# EasyEDA Pro project ProPrj_RP2040 SERVO BOARD_2026-06-01.epro

# Schematic Schematic1
Board Name: Board1; Create Date: 2026-05-31; Page Name: P1; Project Name: RP2040 SERVO BOARD; Schematic Name: Schematic1; Update Date: 2026-05-31; Company: EasyEDA.com; Page Size: A4; Version: V1.0
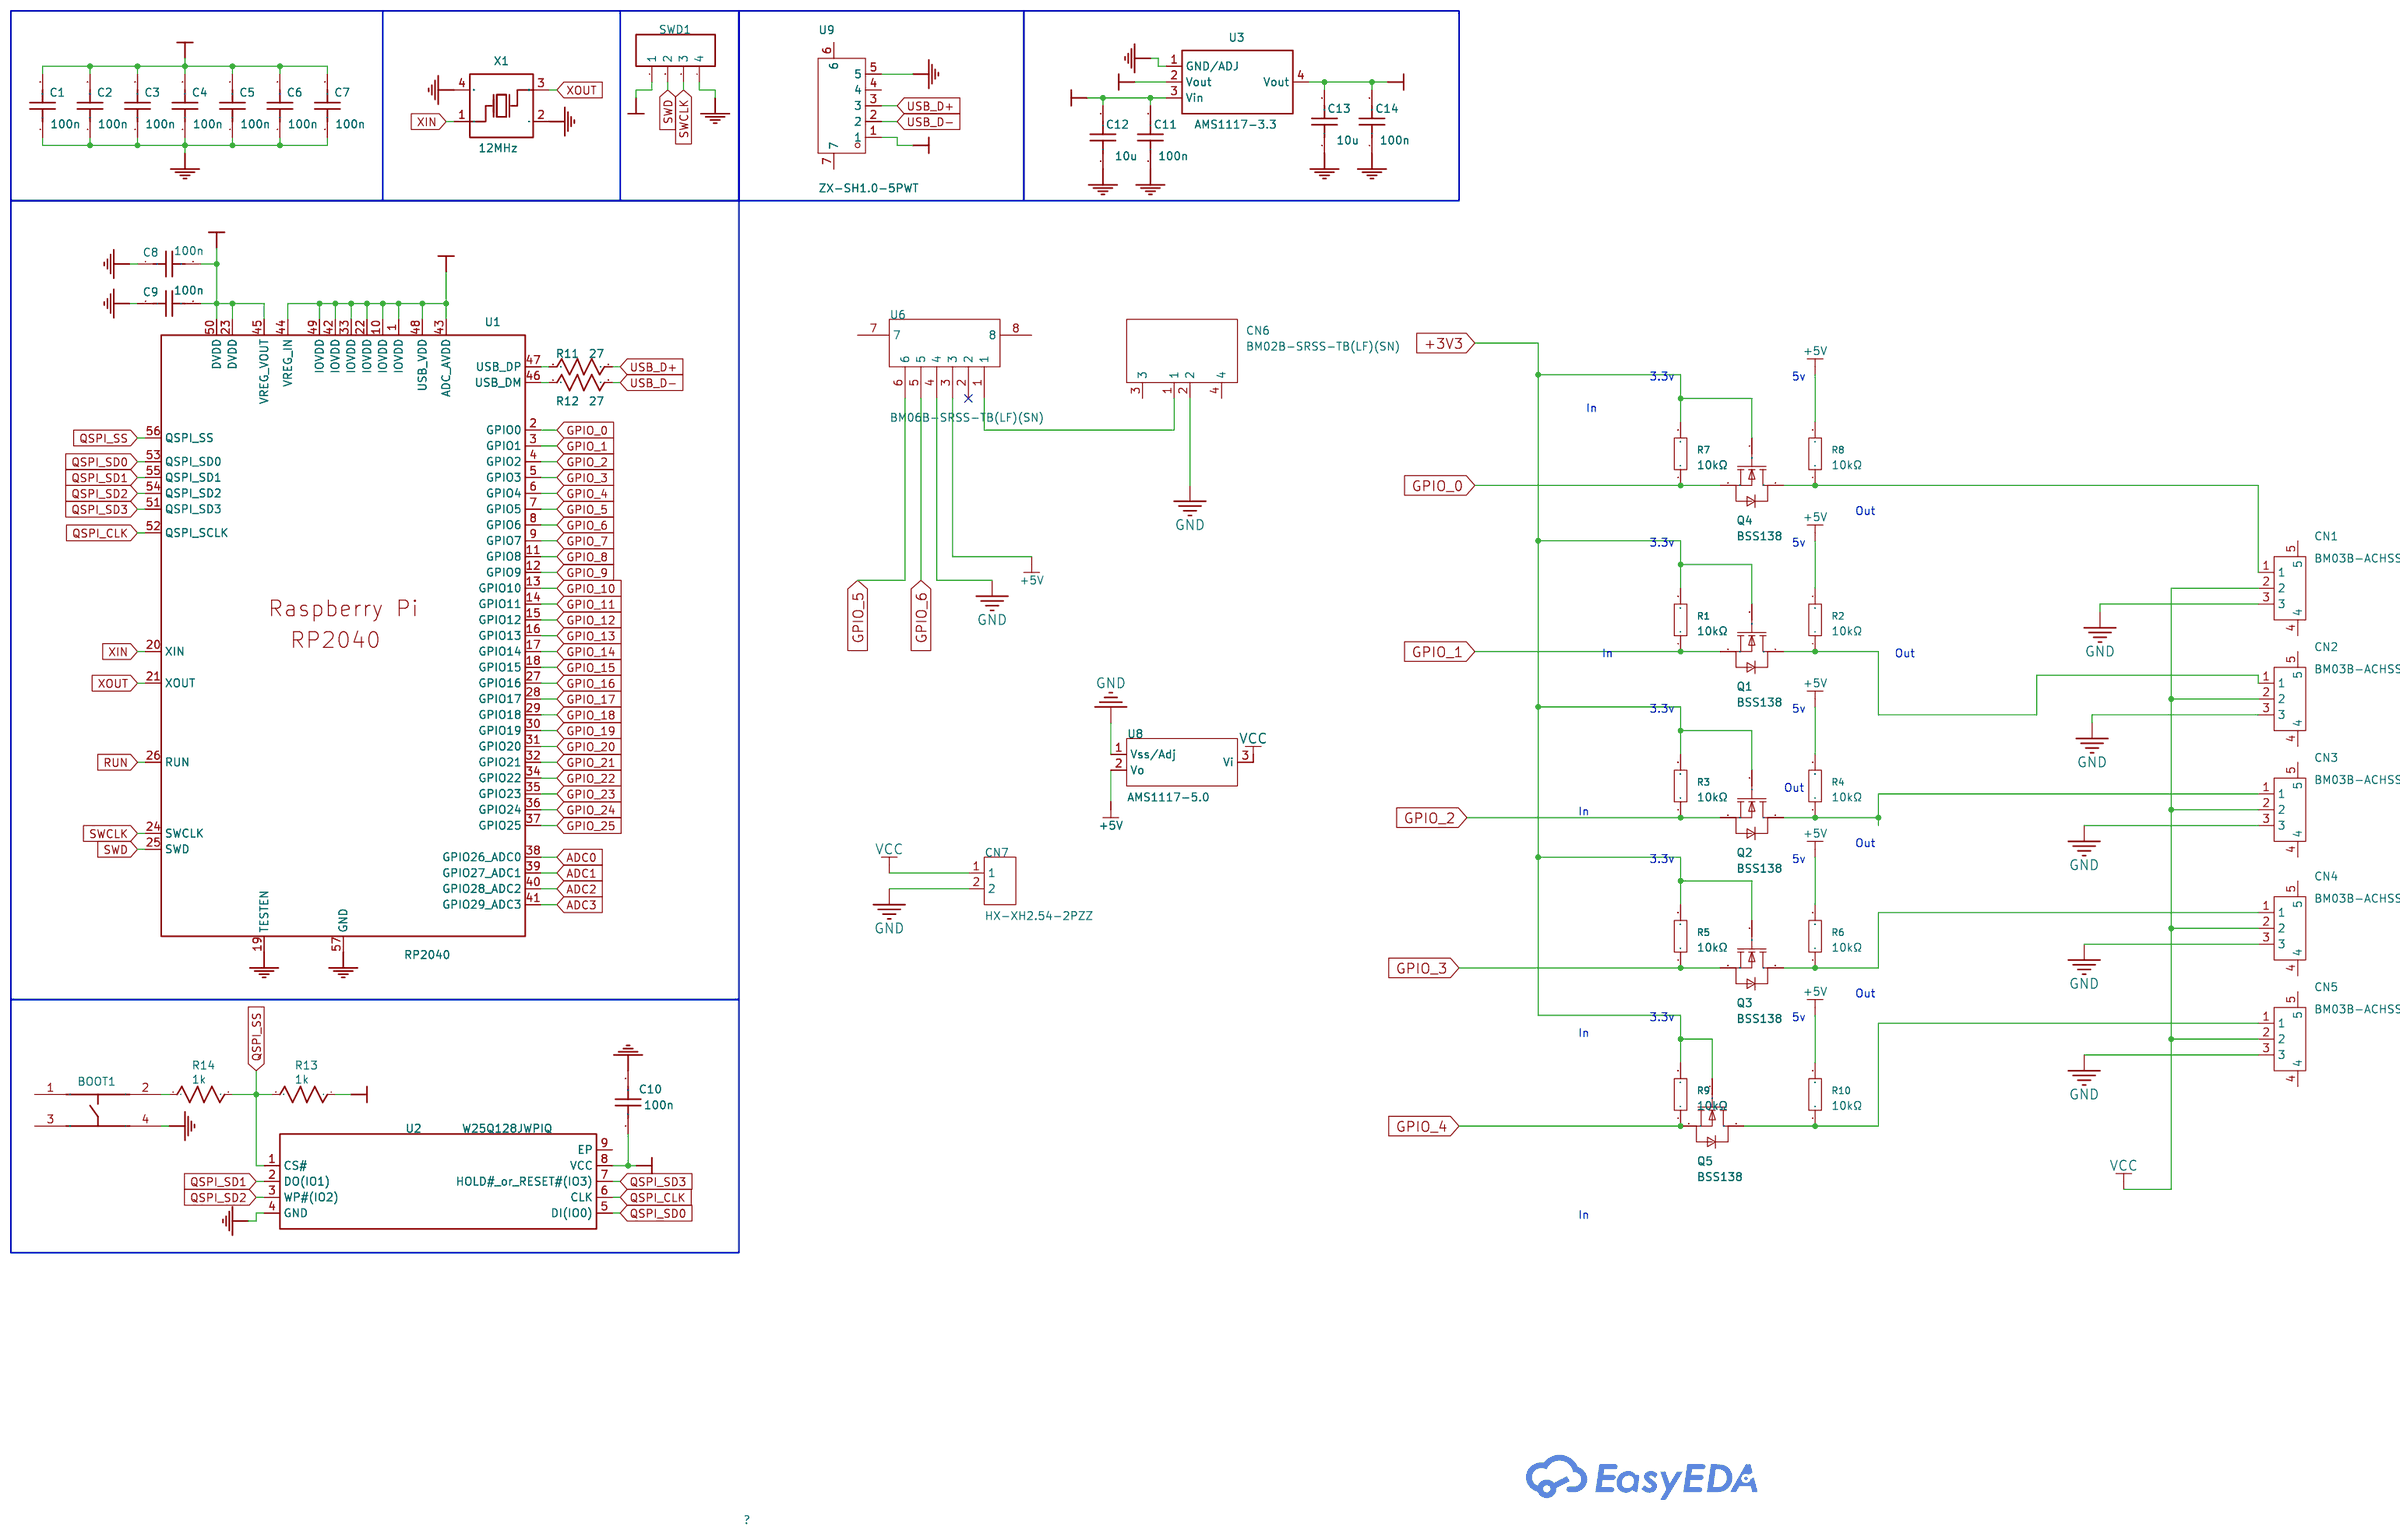
[diagram p0: schematic sheet]

## Parts
BOOT1  PTS810SJM250SMTRLFS  [KEY-SMD_4P-L4.2-W3.2-P2.20-LS4.6]
C1  100n  [C0603]
C2  100n  [C0603]
C3  100n  [C0603]
C4  100n  [C0603]
C5  100n  [C0603]
C6  100n  [C0603]
C7  100n  [C0603]
C8  100n  [C0603]
C9  100n  [C0603]
C10  100n  [C0603]
C11  100n  [C0603]
C12  10u  [C0603]
C13  10u  [C0603]
C14  100n  [C0603]
CN1  BM03B-ACHSS-GAN-TF(LF)(SN)  [CONN-SMD_3P-P1.20_BM03B-ACHSS-GAN-TF]
CN2  BM03B-ACHSS-GAN-TF(LF)(SN)  [CONN-SMD_3P-P1.20_BM03B-ACHSS-GAN-TF]
CN3  BM03B-ACHSS-GAN-TF(LF)(SN)  [CONN-SMD_3P-P1.20_BM03B-ACHSS-GAN-TF]
CN4  BM03B-ACHSS-GAN-TF(LF)(SN)  [CONN-SMD_3P-P1.20_BM03B-ACHSS-GAN-TF]
CN5  BM03B-ACHSS-GAN-TF(LF)(SN)  [CONN-SMD_3P-P1.20_BM03B-ACHSS-GAN-TF]
CN6  BM02B-SRSS-TB(LF)(SN)  [CONN-TH_BM02B-SRSS-TB-LF-SN]
CN7  HX-XH2.54-2PZZ  [CONN-TH_2P-P2.50_HX-2.54MM-2P-ZZ-MS]
Q1  BSS138  [SOT-23-3_L3.0-W1.7-P0.95-LS2.9-BR]
Q2  BSS138  [SOT-23-3_L3.0-W1.7-P0.95-LS2.9-BR]
Q3  BSS138  [SOT-23-3_L3.0-W1.7-P0.95-LS2.9-BR]
Q4  BSS138  [SOT-23-3_L3.0-W1.7-P0.95-LS2.9-BR]
Q5  BSS138  [SOT-23-3_L3.0-W1.7-P0.95-LS2.9-BR]
R1  10kΩ  [R0402]
R2  10kΩ  [R0402]
R3  10kΩ  [R0402]
R4  10kΩ  [R0402]
R5  10kΩ  [R0402]
R6  10kΩ  [R0402]
R7  10kΩ  [R0402]
R8  10kΩ  [R0402]
R9  10kΩ  [R0402]
R10  10kΩ  [R0402]
R11  27  [R0603]
R12  27  [R0603]
R13  1k  [R0603]
R14  1k  [R0603]
SWD1  HDR-M-2.54_1x4  [HDR-M-2.54_1X4]
U1  RP2040  [LQFN-56_L7.0-W7.0-P0.4-EP]
U2  W25Q128JWPIQ  [WSON-8_L6.0-W5.0-P1.27-BL-EP]
U3  AMS1117-3.3  [SOT-223-3_L6.5-W3.4-P2.30-LS7.0-BR]
U6  BM06B-SRSS-TB(LF)(SN)  [CONN-SMD-6P-P1.00_BM06B-SRSS-TB-LF-SN]
U8  AMS1117-5.0  [SOT-89-3_L4.5-W2.5-P1.50-LS4.0-BR-1]
U9  ZX-SH1.0-5PWT  [CONN-SMD_5P-P1.00_MEGASTAR_ZX-SH1.0-5PWT]
X1  12MHz  [CRYSTAL-SMD_4P-L3.2-W2.5-BL]

## Library data of the parts
BOOT1 = PTS810SJM250SMTRLFS: Supplier: LCSC; Supplier Part: C116501; Manufacturer: C&K; JLCPCB Part Class: Extended Part; Contributor: LCSC; spicePre: S
C1-C11 C14 = 100n: nameAlias: Value(F); Contributor: LCEDA_Lib; spicePre: C; spiceSymbolName: C_0603_US
C12 C13 = 10u: nameAlias: Value(F); Contributor: LCEDA_Lib; spicePre: C; spiceSymbolName: C_0603_US
CN1-CN5 = BM03B-ACHSS-GAN-TF(LF)(SN): LCSC Part Name: 可断开压接式连接器，1.2mm间距; Supplier Part: C4353737; Manufacturer: JST; Supplier Footprint: SMD-3P; JLCPCB Part Class: Extended Part; Datasheet: https://item.szlcsc.com/datasheet/BM03B-ACHSS-GAN-TF(LF)(SN)/4924319.html; Supplier: LCSC
CN6 = BM02B-SRSS-TB(LF)(SN): Pins Structure:1x2P Pitch:1mm Mounting Type:Surface Mount,Vertical Reference Series:SH Number of Pins:2P Number of Rows:1 Number of PINs Per Row:2 Row Spacing:- Current Rating:1A Contact Material:Copper Alloy Contact Plating:Tin Operating Temperature:-25℃; LCSC Part Name: 1x2P 间距:1mm 立贴 系列:SH; Supplier Part: C160388; Manufacturer: JST; Supplier Footprint: SMD,P=1mm; JLCPCB Part Class: Extended Part; Datasheet: https://item.szlcsc.com/datasheet/BM02B-SRSS-TB(LF)(SN)/171768.html; Supplier: LCSC; Pins Structure: 1x2P; Pitch: 1mm; Mounting Type: Surface Mount,Vertical; Reference Series: SH; Number of Pins: 2P; Number of Rows: 1; Number of PINs Per Row: 2; Current Rating: 1A; Contact Material: Copper Alloy; Contact Plating: Tin; Operating Temperature: -25℃~+85℃; Voltage Rating: 50V; Plastic Material: PA; Flame Retardant Rating: UL94V-0; Supplementary Features: Auxiliary Solder Pin; Color: White; Z-Height of the Board: 4.25mm; X-Length of Bottom Edge on Board (Spacing Line): 4mm; Y-Width of Bottom Edge on Board: 3.6mm
CN7 = HX-XH2.54-2PZZ: Pins Structure:1x2P Pitch:2.54mm Mounting Type:Straight Reference Series:XH Number of Pins:2P Number of Rows:1 Number of PINs Per Row:2 Row Spacing:- Current Rating:3A Contact Material:Brass Contact Plating:Tin Operating Temperature:-25℃~+85℃ Operating Te; LCSC Part Name: 1x2P 间距:2.5mm 直插 系列:XH; Supplier Part: C42391660; Manufacturer: hanxia(韩下); Supplier Footprint: 插件,P=2.5mm; JLCPCB Part Class: Extended Part; Datasheet: https://item.szlcsc.com/datasheet/HX-XH2.54-2PZZ/44326932.html; Supplier: LCSC; Pins Structure: 1x2P; Pitch: 2.54mm; Mounting Type: Straight; Reference Series: XH; Number of Pins: 2P; Number of Rows: 1; Number of PINs Per Row: 2; Current Rating: 3A; Contact Material: Brass; Contact Plating: Tin; Operating Temperature: -25℃~+85℃; Voltage Rating: 250V; Plastic Material: PA66; Flame Retardant Rating: UL94V-0; Color: White
Q1-Q5 = BSS138_C53058666: Number:1 N-channel Drain to Source Voltage:50V Current - Continuous Drain(Id):- RDS(on):3.5Ω@10V Pd - Power Dissipation:350mW Gate Threshold Voltage (Vgs(th)):1.5V Gate Charge(Qg):- Input Capacitance(Ciss):27pF Reverse Transfer Capacitance (Crss@Vds):6pF; Supplier Part: C53058666; Manufacturer: luJing(鲁晶); Supplier Footprint: SOT-23; JLCPCB Part Class: Extended Part; Datasheet: https://item.szlcsc.com/datasheet/BSS138/56008455.html; Supplier: LCSC; Number: 1 N-channel; Drain to Source Voltage: 50V; RDS(on): 3.5Ω@10V; Pd - Power Dissipation: 350mW; Gate Threshold Voltage (Vgs(th)): 1.5V; Input Capacitance(Ciss): 27pF; Reverse Transfer Capacitance (Crss@Vds): 6pF; Operating Temperature: -55℃~+150℃; Type: N-Channel; Output Capacitance(Coss): 13pF; Vgs: ±20V
R1-R10 = TR0402D10K0Q1025Z: Type:Thin Film Resistor Resistance: Tolerance:±0.5% Tolerance:±0.5% Power(Watts): Overload Voltage (Max): Temperature Coefficient:±25ppm/℃ Temperature Coefficient:±25ppm/℃ Operating Temperature Range:-55℃~+155℃ Operating Temperature Range:-55℃~+155℃; LCSC Part Name: 薄膜电阻 10kΩ ±0.5% 63mW; Supplier Part: C149898; Manufacturer: EVER OHMS(天二科技); Supplier Footprint: 0402; JLCPCB Part Class: Extended Part; Datasheet: https://atta.szlcsc.com/upload/public/pdf/source/20190527/C149900_32B1354086E9F6A772108AB7B2B7A514.pdf; Supplier: LCSC; Type: Thin Film Resistor; Tolerance: ±0.5%; Temperature Coefficient: ±25ppm/℃; Operating Temperature Range: -55℃~+155℃
R11 R12 = 27: nameAlias: Value(Ω); Contributor: LCEDA_Lib; spicePre: R; spiceSymbolName: R_0603_US
R13 R14 = 1k: nameAlias: Value(Ω); Contributor: LCEDA_Lib; spicePre: R; spiceSymbolName: R_0603_US
SWD1 = HDR-M-2.54_1x4: Supplier Part: C124378; Supplier: LCSC; Contributor: LCEDA_Lib; spicePre: J
U1 = RP2040: Supplier: LCSC; Supplier Part: C2040; Manufacturer: Raspberry Pi(树莓派); JLCPCB Part Class: Extended Part; Contributor: LCSC; spicePre: U
U2 = W25Q128JWPIQ: Supplier: LCSC; Supplier Part: C2689660; Manufacturer: WINBOND(华邦); JLCPCB Part Class: Extended Part; Contributor: LCSC; spicePre: U
U3 = AMS1117-3.3: Supplier: LCSC; Manufacturer: AMS; Supplier Part: C6186; JLCPCB Part Class: Basic Part; sourceId: dwIGgezVh; timeStamp: 1476261164; spicePre: U
U6 = BM06B-SRSS-TB(LF)(SN): Pins Structure:1x6P Pitch:1mm Mounting Type:Surface Mount,Vertical Reference Series:SH Number of Pins:6P Number of Rows:1 Number of PINs Per Row:6 Row Spacing:- Current Rating:1A Contact Material:Copper Alloy Contact Plating:Tin Operating Temperature:-25℃; LCSC Part Name: 1x6P 间距:1mm 立贴 系列:SH; Supplier Part: C160392; Manufacturer: JST; Supplier Footprint: SMD,P=1mm; JLCPCB Part Class: Extended Part; Datasheet: https://item.szlcsc.com/datasheet/BM06B-SRSS-TB(LF)(SN)/171772.html; Supplier: LCSC; Pins Structure: 1x6P; Pitch: 1mm; Mounting Type: Surface Mount,Vertical; Reference Series: SH; Number of Pins: 6P; Number of Rows: 1; Number of PINs Per Row: 6; Current Rating: 1A; Contact Material: Copper Alloy; Contact Plating: Tin; Operating Temperature: -25℃~+85℃; Voltage Rating: 50V; Plastic Material: PA; Flame Retardant Rating: UL94V-0; Supplementary Features: Auxiliary Solder Pin; Color: White; Z-Height of the Board: 4.25mm; X-Length of Bottom Edge on Board (Spacing Line): 8mm; Y-Width of Bottom Edge on Board: 3.6mm
U8 = AMS1117-5.0_C42410722: Output Type:Fixed Voltage - Supply:15V Output Voltage:5V Output Voltage:5V Output Current:1A Power Supply Rejection Ratio (PSRR):- Voltage Dropout:1.1V@(1A) standby current:2mA Noise:0.003%Vout Features:Over Current Protection；Short Circuit Protection；The; LCSC Part Name: 5V 1A 15V; Supplier Part: C42410722; Manufacturer: FOSAN(富捷/富信); Supplier Footprint: SOT-89-3L; JLCPCB Part Class: Extended Part; Datasheet: https://item.szlcsc.com/datasheet/AMS1117-5.0/44388993.html; Supplier: LCSC; Output Type: Fixed; Voltage - Supply: 15V; Output Voltage: 5V; Output Current: 1A; Voltage Dropout: 1.1V@(1A); standby current: 2mA; Noise: 0.003%Vout; Features: Over Current Protection；Short Circuit Protection；Thermal Shutdown; Operating Temperature: -40℃~+125℃; Output Configuration: Positive; Number of Outputs: 1
U9 = ZX-SH1.0-5PWT: Pins Structure:1x5P Pitch:1mm Mounting Type:Surface Mount, Right Angle Reference Series:SH Number of Pins:5P Number of Rows:1 Number of PINs Per Row:5 Row Spacing:- Current Rating:1A Contact Material:Brass Contact Plating:Tin Operating Temperature:-40℃~+8; LCSC Part Name: 1x5P 间距:1mm 卧贴 系列:SH; Supplier Part: C7430447; Manufacturer: Megastar(兆星); Supplier Footprint: SMD,P=1mm,卧贴; JLCPCB Part Class: Extended Part; Datasheet: https://item.szlcsc.com/datasheet/ZX-SH1.0-5PWT/8430316.html; Supplier: LCSC; Pins Structure: 1x5P; Pitch: 1mm; Mounting Type: Surface Mount, Right Angle; Reference Series: SH; Number of Pins: 5P; Number of Rows: 1; Number of PINs Per Row: 5; Current Rating: 1A; Contact Material: Brass; Contact Plating: Tin; Operating Temperature: -40℃~+85℃; Voltage Rating: 50V; Plastic Material: LCP; Supplementary Features: Auxiliary Solder Pin; Color: Beige; Z-Height of the Board: 3.15mm; X-Length of Bottom Edge on Board (Spacing Line): 7.35mm; Y-Width of Bottom Edge on Board: 4.3mm
X1 = 12MHz: Supplier: LCSC; Manufacturer: TAE; Manufacturer Part: SMD-3225_4P12M12pf10ppm; Supplier Part: C133337; JLCPCB Part Class: Extended Part; nameAlias: Frequency; Contributor: LCSC; spicePre: X; spiceSymbolName: SMD-3225_4P12M12PF10PPM

## Nets
+1V1: C8.2 C9.2 U1.23(DVDD) U1.45(VREG_VOUT) U1.50(DVDD)
+3.3V: U1.1(IOVDD) U1.10(IOVDD) U1.22(IOVDD) U1.33(IOVDD) U1.42(IOVDD) U1.43(ADC_AVDD) U1.44(VREG_IN) U1.48(USB_VDD) U1.49(IOVDD)
+3V3: C1.2 C2.2 C3.2 C4.2 C5.2 C6.2 C7.2 C10.1 C13.2 C14.2 Q1.1(G) Q2.1(G) Q3.1(G) Q4.1(G) Q5.1(G) R1.2 R3.2 R5.2 R7.2 R9.2 R13.1 SWD1.1 U2.8(VCC) U3.2(Vout) U3.4(Vout)
+5V: C11.2 C12.2 R2.2 R4.2 R6.2 R8.2 R10.2 U3.3(Vin) U6.3 U8.2(Vo) U9.1
GND: BOOT1.4 C1.1 C2.1 C3.1 C4.1 C5.1 C6.1 C7.1 C8.1 C9.1 C10.2 C11.1 C12.1 C13.1 C14.1 CN1.3 CN2.3 CN3.3 CN4.3 CN5.3 CN6.2 CN7.2 SWD1.4 U1.19(TESTEN) U1.57(GND) U2.4(GND) U3.1(GND/ADJ) U6.4 U8.1(Vss/Adj) U9.5 X1.2(GND) X1.4(GND)
VCC: CN1.2 CN2.2 CN3.2 CN4.2 CN5.2 CN7.1 U8.3(Vi)
ADC0: U1.38(GPIO26_ADC0)
ADC1: U1.39(GPIO27_ADC1)
ADC2: U1.40(GPIO28_ADC2)
ADC3: U1.41(GPIO29_ADC3)
GPIO_0: Q4.2(S) R7.1 U1.2(GPIO0)
GPIO_1: Q1.2(S) R1.1 U1.3(GPIO1)
GPIO_2: Q2.2(S) R3.1 U1.4(GPIO2)
GPIO_3: Q3.2(S) R5.1 U1.5(GPIO3)
GPIO_4: Q5.2(S) R9.1 U1.6(GPIO4)
GPIO_5: U1.7(GPIO5) U6.6
GPIO_6: U1.8(GPIO6) U6.5
GPIO_7: U1.9(GPIO7)
GPIO_8: U1.11(GPIO8)
GPIO_9: U1.12(GPIO9)
GPIO_10: U1.13(GPIO10)
GPIO_11: U1.14(GPIO11)
GPIO_12: U1.15(GPIO12)
GPIO_13: U1.16(GPIO13)
GPIO_14: U1.17(GPIO14)
GPIO_15: U1.18(GPIO15)
GPIO_16: U1.27(GPIO16)
GPIO_17: U1.28(GPIO17)
GPIO_18: U1.29(GPIO18)
GPIO_19: U1.30(GPIO19)
GPIO_20: U1.31(GPIO20)
GPIO_21: U1.32(GPIO21)
GPIO_22: U1.34(GPIO22)
GPIO_23: U1.35(GPIO23)
GPIO_24: U1.36(GPIO24)
GPIO_25: U1.37(GPIO25)
QSPI_CLK: U1.52(QSPI_SCLK) U2.6(CLK)
QSPI_SD0: U1.53(QSPI_SD0) U2.5(DI(IO0))
QSPI_SD1: U1.55(QSPI_SD1) U2.2(DO(IO1))
QSPI_SD2: U1.54(QSPI_SD2) U2.3(WP#(IO2))
QSPI_SD3: U1.51(QSPI_SD3) U2.7(HOLD# or RESET#(IO3))
QSPI_SS: R13.2 R14.2 U1.56(QSPI_SS) U2.1(CS#)
RUN: U1.26(RUN)
SWCLK: SWD1.3 U1.24(SWCLK)
SWD: SWD1.2 U1.25(SWD)
USB_D+: R11.2 U9.3
USB_D-: R12.2 U9.2
XIN: U1.20(XIN) X1.1(OSC1)
XOUT: U1.21(XOUT) X1.3(OSC2)
$1N3777: CN6.1 U6.1
$1N4045: CN1.1 Q4.3(D) R8.1
$1N4059: CN2.1 Q1.3(D) R2.1
$1N4218: CN3.1 Q2.3(D) R4.1
$1N4230: CN4.1 Q3.3(D) R6.1
$1N6983: R12.1 U1.46(USB_DM)
$1N6984: R11.1 U1.47(USB_DP)
$1N7040: BOOT1.2 R14.1
$1N10693: CN5.1 Q5.3(D) R10.1

Not connected (* = marked no-connect by the designer): BOOT1 1 3; CN1 4 5; CN2 4 5; CN3 4 5; CN4 4 5; CN5 4 5; CN6 3 4; U2 9(EP); U6 2* 7 8; U9 4 6 7

## Notes on the sheet
- 3.3v
- 5v
- In
- Out
- 3.3v
- 5v
- In
- Out
- 3.3v
- 5v
- Out
- In
- Out
- 3.3v
- 5v
- Out
- 3.3v
- 5v
- In
- In

# Board PCB1
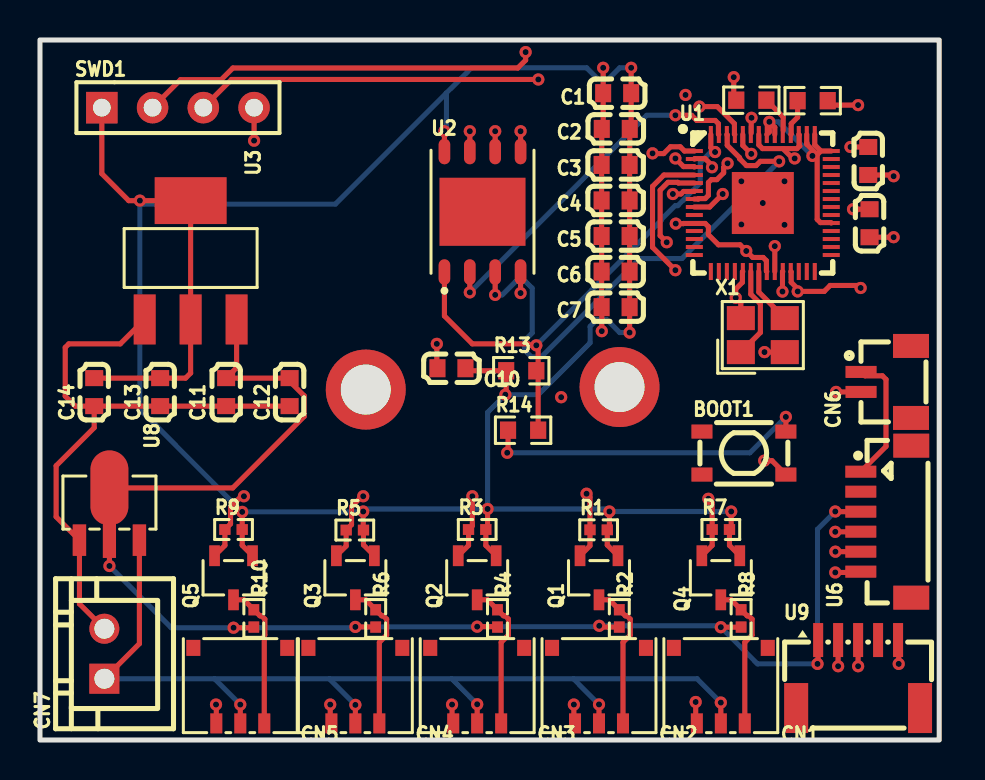
[diagram p1: board, top side]
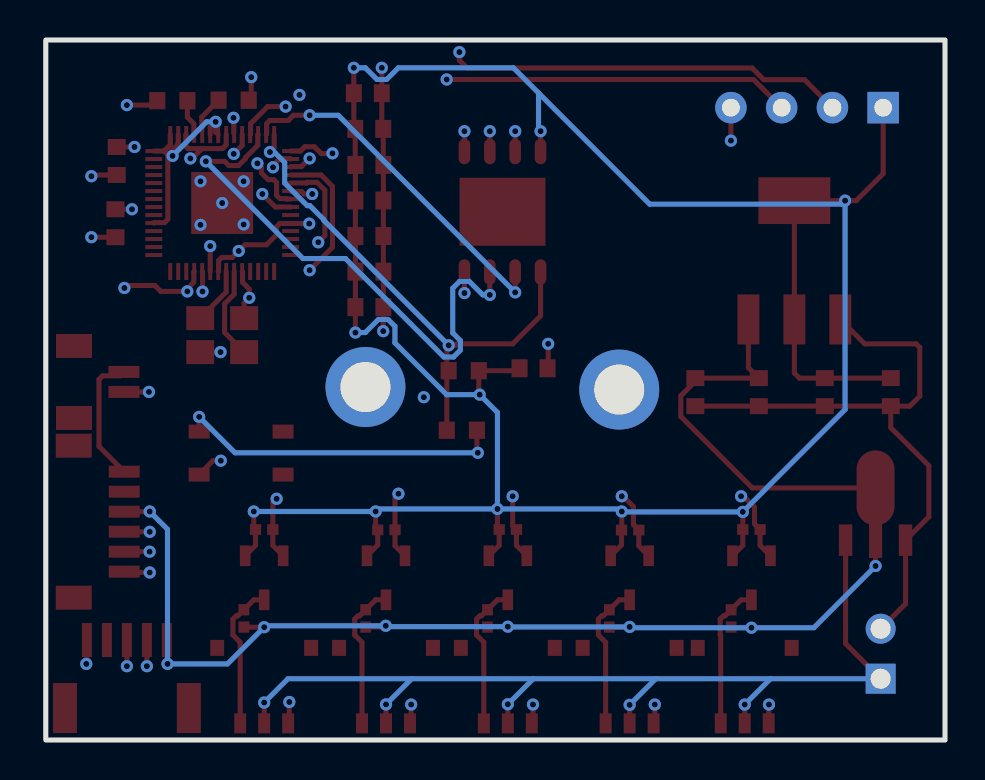
[diagram p2: board, bottom side, seen from below]

Outline 45 x 35 mm; copper layers: Top Layer, Inner1, Inner2, Bottom Layer. Coordinates in mm from the lower left corner of the outline.
Outline path: rectangle 0,0 45,35
Stack: Top Layer 0.035mm Outer layer thickness 1oz / Dielectric1 0.2104mm 7628 RC49% 8.6mil / Inner1 0.0152mm Inner layer thickness / Dielectric2 1.065mm 1.1mm H/HOZ Copper / Inner2 0.0152mm Inner layer thickness / Dielectric3 0.2104mm 7628 RC49% 8.6mil / Bottom Layer 0.035mm Outer layer thickness 1oz

## Design rules (mm)
template: JLCPCB Capability(Two Layers Board)
spacing copperThickness1oz (default): track to track 0.102, other pairs 0.152 to 0.3
spacing copperThickness2oz: track to track 0.203, other pairs 0.152 to 0.3
track width copperThickness1oz (default): min 0.127, default 0.254, max 2.54
track width copperThickness2oz: min 0.203, default 0.254, max 2.54
differential pair differentialPair (default): width min 0.127, default 0.254, max 2.54; gap min 0.152, default 0.152
via viaSize (default): diameter min 0.5, default 0.61, max 10; hole min 0.3, default 0.305, max 6.3

## Placement (name value [footprint] x y rotation side)
BOOT1  PTS810SJM250SMTRLFS  [KEY-SMD_4P-L4.2-W3.2-P2.20-LS4.6]  35.23 14.35 0 top
C1  100n  [C0603]  28.88 32.34 0 top
C2  100n  [C0603]  28.81 30.56 0 top
C3  100n  [C0603]  28.81 28.75 0 top
C4  100n  [C0603]  28.81 26.98 0 top
C5  100n  [C0603]  28.81 25.2 0 top
C6  100n  [C0603]  28.81 23.42 0 top
C7  100n  [C0603]  28.81 21.64 0 top
C8  100n  [C0603]  41.45 28.95 90 top
C9  100n  [C0603]  41.51 25.84 90 top
C10  100n  [C0603]  20.59 18.59 180 top
C11  100n  [C0603]  9.32 17.39 90 top
C12  10u  [C0603]  12.49 17.39 90 top
C13  10u  [C0603]  6.02 17.39 90 top
C14  100n  [C0603]  2.71 17.39 90 top
CN1  BM03B-ACHSS-GAN-TF(LF)(SN)  [CONN-SMD_3P-P1.20_BM03B-ACHSS-GAN-TF]  34.07 2.72 180 top
CN2  BM03B-ACHSS-GAN-TF(LF)(SN)  [CONN-SMD_3P-P1.20_BM03B-ACHSS-GAN-TF]  27.97 2.72 180 top
CN3  BM03B-ACHSS-GAN-TF(LF)(SN)  [CONN-SMD_3P-P1.20_BM03B-ACHSS-GAN-TF]  21.88 2.72 180 top
CN4  BM03B-ACHSS-GAN-TF(LF)(SN)  [CONN-SMD_3P-P1.20_BM03B-ACHSS-GAN-TF]  15.78 2.72 180 top
CN5  BM03B-ACHSS-GAN-TF(LF)(SN)  [CONN-SMD_3P-P1.20_BM03B-ACHSS-GAN-TF]  10.03 2.72 180 top
CN6  BM02B-SRSS-TB(LF)(SN)  [CONN-TH_BM02B-SRSS-TB-LF-SN]  42.34 17.9 90 top
CN7  HX-XH2.54-2PZZ  [CONN-TH_2P-P2.50_HX-2.54MM-2P-ZZ-MS]  3.22 4.31 90 top
NOREF  -  [Pad_e1]  16.3 17.52 0 top
NOREF#2  -  [Pad_e9791]  29 17.65 0 top
Q1  BSS138  [SOT-23-3_L3.0-W1.7-P0.95-LS2.9-BR]  27.97 8.11 90 top
Q2  BSS138  [SOT-23-3_L3.0-W1.7-P0.95-LS2.9-BR]  21.88 8.11 90 top
Q3  BSS138  [SOT-23-3_L3.0-W1.7-P0.95-LS2.9-BR]  15.78 8.11 90 top
Q4  BSS138  [SOT-23-3_L3.0-W1.7-P0.95-LS2.9-BR]  34.07 8.11 90 top
Q5  BSS138  [SOT-23-3_L3.0-W1.7-P0.95-LS2.9-BR]  9.69 8.11 90 top
R1  10kΩ  [R0402]  27.96 10.51 0 top
R2  10kΩ  [R0402]  28.99 6.08 270 top
R3  10kΩ  [R0402]  21.88 10.52 0 top
R4  10kΩ  [R0402]  22.9 6.08 270 top
R5  10kΩ  [R0402]  15.76 10.5 0 top
R6  10kΩ  [R0402]  16.8 6.08 270 top
R7  10kΩ  [R0402]  34.07 10.52 0 top
R8  10kΩ  [R0402]  35.09 6.08 270 top
R9  10kΩ  [R0402]  9.69 10.52 0 top
R10  10kΩ  [R0402]  10.7 6.08 270 top
R11  27  [R0603]  35.6 31.99 180 top
R12  27  [R0603]  38.67 31.97 0 top
R13  1k  [R0603]  24.08 18.46 0 top
R14  1k  [R0603]  24.18 15.49 0 top
SWD1  HDR-M-2.54_1x4  [HDR-M-2.54_1X4]  6.91 31.62 0 top
U1  RP2040  [LQFN-56_L7.0-W7.0-P0.4-EP]  36.17 26.85 0 top
U2  W25Q128JWPIQ  [WSON-8_L6.0-W5.0-P1.27-BL-EP]  22.15 26.41 0 top
U3  AMS1117-3.3  [SOT-223-3_L6.5-W3.4-P2.30-LS7.0-BR]  7.54 24 270 top
U6  BM06B-SRSS-TB(LF)(SN)  [CONN-SMD-6P-P1.00_BM06B-SRSS-TB-LF-SN]  42.34 10.92 90 top
U8  AMS1117-5.0  [SOT-89-3_L4.5-W2.5-P1.50-LS4.0-BR-1]  3.48 11.3 270 top
U9  ZX-SH1.0-5PWT  [CONN-SMD_5P-P1.00_MEGASTAR_ZX-SH1.0-5PWT]  40.94 3.3 0 top
X1  12MHz  [CRYSTAL-SMD_4P-L3.2-W2.5-BL]  36.17 20.25 0 top

## Footprints (pads in the part's own frame, mm; a bottom-side part is the same pattern mirrored in y, then rotated)
C0603
  rect 0.8x0.9 smd: 1(-0.7,0) 2(0.7,0)
CONN-SMD-6P-P1.00_BM06B-SRSS-TB-LF-SN
  rect 0.6x1.55 smd: 1(2.499,1.263) 2(1.5,1.263) 3(0.499,1.263) 4(-0.5,1.263) 5(-1.5,1.263) 6(-2.5,1.262)
  rect 1.2x1.8 smd: 7(-3.8,-1.263) 8(3.8,-1.263)
CONN-SMD_3P-P1.20_BM03B-ACHSS-GAN-TF
  rect 0.6x1 smd: 1(-1.2,1.887) 2(0,1.887) 3(1.2,1.887)
  rect 0.7x0.8 smd: 4(2.35,-1.887) 5(-2.35,-1.887)
CONN-SMD_5P-P1.00_MEGASTAR_ZX-SH1.0-5PWT
  rect 0.5x1.7 smd: 1(-2,1.7) 2(-1,1.7) 3(0,1.7) 4(1,1.7) 5(2,1.7)
  rect 1.2x2.5 smd: 6(3.1,-1.7) 7(-3.1,-1.7)
CONN-TH_2P-P2.50_HX-2.54MM-2P-ZZ-MS
  rect 1.5x1.5 hole 1: 1(-1.25,0)
  round 1.5 hole 1: 2(1.25,0)
CONN-TH_BM02B-SRSS-TB-LF-SN
  rect 0.6x1.55 smd: 1(0.502,1.25) 2(-0.498,1.25)
  rect 1.2x1.8 smd: 3(1.8,-1.25) 4(-1.8,-1.25)
CRYSTAL-SMD_4P-L3.2-W2.5-BL
  rect 1.4x1.2 smd: 1(-1.1,-0.85) 2(1.1,-0.85) 3(1.1,0.85) 4(-1.1,0.85)
HDR-M-2.54_1X4
  rect 1.575x1.575 hole 0.889: 1(-3.81,0)
  round 1.575 hole 0.889: 2(-1.27,0) 3(1.27,0) 4(3.81,0)
KEY-SMD_4P-L4.2-W3.2-P2.20-LS4.6
  rect 1.05x0.7 smd: 1(-2.1,1.075) 2(2.1,1.075) 3(-2.1,-1.075) 4(2.1,-1.075)
LQFN-56_L7.0-W7.0-P0.4-EP
  rect 0.85x0.2 smd: 1(-3.425,2.6) 2(-3.425,2.2) 3(-3.425,1.8) 4(-3.425,1.4) 5(-3.425,1) 6(-3.425,0.6) 7(-3.425,0.2) 8(-3.425,-0.2) 9(-3.425,-0.6) 10(-3.425,-1) 11(-3.425,-1.4) 12(-3.425,-1.8) 13(-3.425,-2.2) 14(-3.425,-2.6) 29(3.425,-2.6) 30(3.425,-2.2) 31(3.425,-1.8) 32(3.425,-1.4) 33(3.425,-1) 34(3.425,-0.6) 35(3.425,-0.2) 36(3.425,0.2) 37(3.425,0.6) 38(3.425,1) 39(3.425,1.4) 40(3.425,1.8) 41(3.425,2.2) 42(3.425,2.6)
  rect 0.2x0.85 smd: 15(-2.6,-3.425) 16(-2.2,-3.425) 17(-1.8,-3.425) 18(-1.4,-3.425) 19(-1,-3.425) 20(-0.6,-3.425) 21(-0.2,-3.425) 22(0.2,-3.425) 23(0.6,-3.425) 24(1,-3.425) 25(1.4,-3.425) 26(1.8,-3.425) 27(2.2,-3.425) 28(2.6,-3.425) 43(2.6,3.425) 44(2.2,3.425) 45(1.8,3.425) 46(1.4,3.425) 47(1,3.425) 48(0.6,3.425) 49(0.2,3.425) 50(-0.2,3.425) 51(-0.6,3.425) 52(-1,3.425) 53(-1.4,3.425) 54(-1.8,3.425) 55(-2.2,3.425) 56(-2.6,3.425)
  rect 3.1x3.1 smd: 57(0,0)
Pad_e1
  round 4 hole 2.5: 1(0,0)
Pad_e9791
  round 4 hole 2.5: 1(0,0)
R0402
  rect 0.566x0.54 smd: 1(-0.433,0) 2(0.433,0)
R0603
  rect 0.806x0.864 smd: 1(-0.753,0) 2(0.753,0)
SOT-23-3_L3.0-W1.7-P0.95-LS2.9-BR
  rect 1.038x0.532 smd: 1(1.101,-0.95) 2(1.101,0.95) 3(-1.101,0)
SOT-89-3_L4.5-W2.5-P1.50-LS4.0-BR-1
  rect 1.575x0.672 smd: 1(1.306,-1.5) 3(1.306,1.5)
  custom 5.377x1.9 smd: 2(-1.306,0)
SOT-223-3_L6.5-W3.4-P2.30-LS7.0-BR
  rect 2.5x1.1 smd: 1(2.97,-2.3) 2(2.97,0) 3(2.97,2.3)
  rect 2.34x3.6 smd: 4(-2.97,0)
WSON-8_L6.0-W5.0-P1.27-BL-EP
  oval 0.581x1.276 smd: 1(-1.905,-3.013) 2(-0.635,-3.013) 3(0.635,-3.013) 4(1.905,-3.013) 5(1.905,3.013) 6(0.635,3.013) 7(-0.635,3.013) 8(-1.905,3.013)
  rect 4.3x3.4 smd: 9(0,0)

## Nets
As in the schematic.

Pads without a net: BOOT1 1 3; CN1 4 5; CN2 4 5; CN3 4 5; CN4 4 5; CN5 4 5; CN6 3 4; NOREF 1; NOREF#2 1; U2 9; U6 2 7 8; U9 4 6 7

## Via types
v1: diameter 0.61, hole 0.305, Top Layer to Bottom Layer, 94 vias

## Routing (per net, layer and track width the routed paths; a pad name or vN(x,y) marks a point on that pad's centre or on a via; arc(x,y) is an arc through that point)
+1V1: length 18.6
  Top Layer w0.254: 37.18,29.57 37.67,29.08 v1(37.77,29.08) ; 37.18,29.57 36.16,29.57 35.97,29.75 U1.50 ; 37.18,29.57 37.88,29.57 38.02,29.71 37.99,29.73 37.99,30.25 U1.45 ; U1.23 v1(36.77,24.69) ; v1(40.56,29.65) C8.2 ; v1(40.69,26.54) C9.2
  Inner1 w0.254: v1(36.77,24.69) 37.32,24.69 37.89,25.27 37.89,28.95 v1(37.77,29.08) 38.07,29.38 38.07,29.45 38.41,29.79 38.9,29.79 39.03,29.65 v1(40.56,29.65) 40.69,29.52 v1(40.69,26.54)
+3.3V: length 31.8
  Top Layer w0.254: v1(31.82,25.82) 32.2,25.82 32.21,25.83 33.29,25.83 33.45,25.66 33.45,25.27 33.96,24.76 35.04,24.76 v1(35.34,24.45) 35.67,24.13 36.19,24.13 36.35,23.96 36.35,23.45 U1.22 ; 38.89,29.26 38.38,29.78 38.38,29.85 38.37,29.86 U1.44 ; 38.89,29.26 39.08,29.45 ; 38.89,29.26 38.89,26.03 39.06,25.87 39.58,25.87 U1.33 ; U1.48 36.77,30.64 v1(36.5,30.91) 36.5,30.4 U1.49 ; 39.08,29.45 39.6,29.45 ; 39.08,29.45 38.77,29.75 U1.43 ; v1(30.65,29.33) 30.67,29.32 31.21,29.32 31.56,29.66 32.04,29.66 32.25,29.45 32.75,29.45
  Inner1 w0.254: v1(35.34,24.45) 36.19,24.45 36.53,24.11 37.24,24.11 38.25,25.12 38.25,27.36 38.66,27.76 v1(38.66,29.21) ; v1(31.82,25.82) 31.82,26.62 32.25,27.06 32.25,27.54 31.91,27.88 31.91,28.07 v1(30.65,29.33)
  Bottom Layer w0.254: v1(38.66,29.21) 36.95,30.91 v1(36.5,30.91)
+3V3: length 138.6
  Top Layer w0.254: v1(34.59,11.43) 34.59,10.61 R7.2 34.5,9.73 35.02,9.21 ; C14.2 C13.2 7.29,18.09 7.54,18.35 U3.2 U3.4 v1(5,26.97) 4.44,26.97 3.09,28.32 SWD1.1 ; v1(10.12,11.41) R9.2 10.12,9.73 Q5.1 ; v1(22.4,11.55) 22.4,10.61 R3.2 22.31,9.73 22.83,9.21 ; v1(29.51,20.37) C7.2 C6.2 C5.2 C4.2 C3.2 29.51,28.76 C2.2 29.58,30.63 C1.2 v1(29.58,33.61) ; 28.93,9.21 28.39,9.75 R1.2 28.5,10.61 v1(28.5,11.43) ; v1(16.18,11.43) 16.18,10.51 R5.2 16.19,9.76 Q3.1 ; U2.8 v1(20.24,30.44) ; v1(23.29,17.27) 23.33,17.31 R13.1 21.42,18.46 C10.1
  Bottom Layer w0.254: v1(22.4,11.55) 16.3,11.55 v1(16.18,11.43) 16.16,11.41 v1(10.12,11.41) 5,16.52 v1(5,26.97) 5.18,26.79 14.78,26.79 20.34,32.35 ; v1(22.4,11.55) 22.4,16.38 v1(23.29,17.27) 24.94,17.27 27.53,19.86 27.53,20.68 27.87,21.03 28.36,21.03 29.01,20.37 v1(29.51,20.37) ; v1(22.4,11.55) 28.37,11.55 v1(28.5,11.43) v1(34.59,11.43) ; 20.34,32.35 20.34,30.54 v1(20.24,30.44) ; 20.34,32.35 21.6,33.61 27.36,33.61 27.94,33.03 28.43,33.03 29.01,33.61 v1(29.58,33.61)
+5V: length 76.8
  Top Layer w0.254: R2.2 28.05,5.65 v1(27.99,5.71) ; v1(9.69,5.61) 10.67,5.61 R10.2 ; U9.1 38.94,3.84 v1(38.91,3.81) ; v1(39.8,11.43) 39.81,11.42 U6.3 ; v1(34.07,5.64) 35.08,5.64 R8.2 ; v1(3.48,8.7) U8.2 9.65,12.6 13.22,16.18 13.22,17.21 12.49,17.94 C12.2 C11.2 9.84,18.62 U3.3 ; R4.2 22.88,5.67 v1(21.88,5.67) ; v1(15.78,5.65) 16.79,5.65 R6.2
  Bottom Layer w0.254: v1(39.8,11.43) 38.91,10.54 v1(38.91,3.81) 35.91,3.81 v1(34.07,5.64) 34,5.71 v1(27.99,5.71) 27.94,5.67 v1(21.88,5.67) 21.87,5.65 v1(15.78,5.65) 15.74,5.61 v1(9.69,5.61) 6.56,5.61 v1(3.48,8.7)
GND: length 64.6
  Top Layer w0.254: U3.1 4.02,19.81 1.44,19.81 1.26,19.63 1.26,17.19 1.76,16.69 C14.1 ; C14.1 C13.1 C11.1 C12.1 ; C14.1 2.71,15.62 0.81,13.71 0.81,11.16 U8.1 1.98,6.81 CN7.2 ; v1(10.72,29.97) SWD1.4 ; v1(32.81,1.9) 32.81,0.89 32.87,0.83 ; CN5.3 8.83,1.76 v1(8.81,1.77) ; C8.1 42.66,28.25 v1(42.72,28.19) ; v1(24.05,22.35) U2.4 ; v1(14.53,1.77) 14.53,0.89 14.58,0.83 ; v1(42.72,25.14) 42.72,25.14 C9.1 ; v1(26.72,1.77) 26.72,0.89 26.78,0.83 ; v1(19.86,19.81) 19.86,18.62 C10.2 ; v1(39.8,10.41) 41.07,10.41 U6.4 ; v1(28.18,33.61) C1.1 28.18,30.63 C2.1 28.11,28.76 C3.1 C4.1 C5.1 C6.1 C7.1 28.11,21.63 v1(28.11,20.44) ; 20.68,0.83 20.62,0.89 v1(20.62,1.77) ; X1.4 35.07,21.86 v1(34.82,22.11) 34.82,22.55 35.15,22.88 35.15,23.4 U1.19 ; v1(36.26,19.4) X1.2 ; v1(36.24,13.97) 36.63,13.97 BOOT1.4 ; CN6.2 v1(39.84,17.4) ; U9.5 42.97,4.97 v1(42.97,3.81)
  vias: v1(35.1,27.94) v1(35.1,25.78) v1(36.17,26.85) v1(37.26,27.94) v1(37.26,25.76)
VCC: length 51.1
  Top Layer w0.254: v1(15.78,1.76) CN4.2 ; CN7.1 4.98,4.82 U8.3 ; v1(21.88,1.79) CN3.2 ; v1(27.97,1.78) CN2.2 ; v1(34.07,1.87) CN1.2 ; v1(10.02,1.77) 10.02,0.83
  Bottom Layer w0.254: 26.69,3.06 32.88,3.06 v1(34.07,1.87) ; 26.69,3.06 v1(27.97,1.78) ; 26.69,3.06 20.6,3.06 ; 14.48,3.06 v1(15.78,1.76) ; 14.48,3.06 20.6,3.06 ; 14.48,3.06 8.73,3.06 ; 20.6,3.06 v1(21.88,1.79) ; 8.73,3.06 v1(10.02,1.77) ; 8.73,3.06 CN7.1
GPIO_0: length 21.2
  Top Layer w0.254: Q4.2 33.64,9.73 R7.1 33.64,11.87 v1(33.45,12.06) ; U1.2 32.77,29.07 33.29,29.07 33.63,28.73 v1(33.63,28.64)
  Inner1 w0.254: v1(33.45,12.06) 33.45,20.36 33.14,20.66 33.14,28.15 v1(33.63,28.64)
GPIO_1: length 27.3
  Top Layer w0.254: U1.3 32.73,28.67 32.21,28.67 v1(31.8,29.08) ; v1(27.35,12.31) 27.52,12.14 R1.1 27.52,9.71 Q1.2
  Inner1 w0.254: v1(31.8,29.08) 32.1,29.38 32.76,29.38 32.94,29.21 32.94,28.95 32.79,28.79 32.79,20.51 32.94,20.36 32.94,14.22 31.03,12.31 v1(27.35,12.31)
GPIO_2: length 31.4
  Top Layer w0.254: U1.4 31.22,28.25 30.65,27.68 30.65,24.63 v1(31.8,23.49) ; v1(21.64,12.19) 21.64,10.71 R3.1 21.45,9.73 Q2.2
  Inner1 w0.254: v1(21.64,12.19) 26.4,12.19 27.11,12.9 30.86,12.9 32.56,14.6 32.56,20.24 32.43,20.37 32.43,22.86 v1(31.8,23.49)
GPIO_3: length 36.4
  Top Layer w0.254: Q3.2 15.32,9.7 R5.1 15.59,10.77 15.59,11.67 16.11,12.19 v1(16.18,12.19) ; v1(31.37,24.89) 31.03,25.22 31.03,27.49 31.43,27.88 31.91,27.88 31.95,27.85 U1.5
  Inner1 w0.254: v1(16.18,12.19) 20.81,12.19 21.88,13.25 30.45,13.25 32.05,14.85 32.05,22.41 31.21,23.25 31.21,23.73 32.05,24.57 31.68,24.57 v1(31.37,24.89)
GPIO_4: length 40.2
  Top Layer w0.254: 32.75,27.45 32.73,27.43 32.21,27.43 32.08,27.3 v1(31.67,27.3) ; v1(10.21,12.19) 10.08,12.19 9.54,11.65 9.54,10.81 R9.1 9.25,9.73 Q5.2
  Inner1 w0.254: v1(31.67,27.3) 30.78,26.41 30.78,21.59 31.54,20.82 31.54,15.11 30.05,13.61 16.77,13.61 15.35,12.19 v1(10.21,12.19)
GPIO_5: length 27.6
  Top Layer w0.254: v1(39.8,8.38) 41.04,8.38 U6.6 ; U1.7 32.94,27.05 32.96,27.07 33.29,27.07 33.45,27.23 33.45,27.87 33.59,28.02 33.87,28.02 34.21,28.36 34.21,28.64 v1(34.41,28.83)
  Inner1 w0.254: v1(39.8,8.38) 37.91,10.27 37.91,16.4 33.73,20.58 33.73,26.91 33.58,27.06 33.58,27.54 34.41,28.37 v1(34.41,28.83)
GPIO_6: length 23.6
  Top Layer w0.254: U6.5 v1(39.81,9.42) ; v1(34.16,27.3) 33.51,26.65 U1.8
  Inner1 w0.254: v1(34.16,27.3) 34.27,27.19 34.27,26.32 34.42,26.18 34.42,23.2 34.27,23.06 34.27,22.39 34.23,22.35 34.23,21.87 34.27,21.83 34.27,20.54 38.27,16.55 38.27,15.39 38.38,15.27 38.38,10.3 39.26,9.42 v1(39.81,9.42)
QSPI_CLK: length 17.4
  Top Layer w0.254: v1(35.59,29.31) 35.17,29.73 U1.52 ; U2.6 v1(22.78,30.44)
  Inner1 w0.254: v1(22.78,30.44) 24.59,32.25 v1(32.31,32.25) 33.36,32.25 35.21,30.4 35.21,29.69 v1(35.59,29.31)
QSPI_SD0: length 13.2
  Top Layer w0.254: U2.5 v1(24.05,30.44) ; U1.53 34.75,30.3 34.75,30.81 33.9,31.67 v1(33,31.67)
  Inner1 w0.254: v1(24.05,30.44) 31.77,30.44 31.98,30.65 32.04,30.65 32.38,31 32.38,31.05 v1(33,31.67)
QSPI_SD1: length 17.8
  Top Layer w0.254: v1(31.8,31.24) 32.61,31.24 32.87,30.98 33.79,30.98 33.95,30.81 33.95,30.3 U1.55 ; v1(21.51,22.38) U2.2
  Bottom Layer w0.254: v1(31.8,31.24) 30.36,31.24 v1(21.51,22.38)
QSPI_SD2: length 27.3
  Top Layer w0.254: U1.54 34.39,30.25 34.39,29.73 35.01,29.12 35.01,29.06 35.35,28.72 35.84,28.72 36.05,28.93 v1(36.99,28.93) ; v1(22.78,22.26) U2.3
  Bottom Layer w0.254: v1(36.99,28.93) 32.13,24.07 30,24.07 25.08,19.15 24.6,19.15 24.25,19.49 24.25,19.98 24.63,20.36 24.63,22.59 24.29,22.93 23.81,22.93 23.13,22.26 v1(22.78,22.26)
QSPI_SD3: length 20.2
  Top Layer w0.254: 35.59,30.35 35.59,31.1 v1(35.61,31.11) ; U2.7 v1(21.51,30.44)
  Inner1 w0.254: v1(21.51,30.44) 21.64,30.31 21.64,30.25 21.9,29.98 22.41,29.98 22.54,29.86 24.29,29.86 24.42,29.98 34.09,29.98 35.51,28.57 35.99,28.57 36.41,28.99 36.41,29.36 35.61,30.16 v1(35.61,31.11)
QSPI_SS: length 29.3
  Top Layer w0.254: v1(33.78,29.4) 33.57,29.61 U1.56 ; U2.1 20.24,21.2 21.64,19.81 24.43,19.81 24.5,19.73 v1(24.84,19.73) 24.93,19.64 R14.2
  Inner1 w0.254: v1(26.08,17.14) 26.08,18.49 v1(24.84,19.73)
  Bottom Layer w0.254: v1(33.78,29.4) 33.56,29.4 33.05,28.88 33.05,27.85 31.91,26.72 31.78,26.72 31.09,26.02 31.09,25.98 v1(24.84,19.73)
SWCLK: length 50
  Top Layer w0.254: U1.24 37.16,23.41 v1(37.16,22.42) ; v1(24.94,33.03) 9.58,33.03 SWD1.3
  Inner1 w0.254: v1(37.16,22.42) 36.7,21.97 36.7,21.55 37.81,20.44 38.66,20.44 40.43,22.22 40.43,25.46 41.27,26.3 41.27,26.78 41.04,27.01 41.04,29.31 41.14,29.41 41.14,29.89 39.34,31.69 34.43,31.69 33.09,33.03 v1(24.94,33.03)
SWD: length 51.2
  Top Layer w0.254: SWD1.2 7.03,33.02 9.07,33.02 9.65,33.6 23.91,33.6 24.3,33.99 v1(24.3,34.4) ; v1(41.07,22.6) 40.94,22.73 39.54,22.73 39.25,22.43 v1(37.92,22.43) 37.92,22.56 37.59,22.88 37.59,23.4 U1.25
  Inner1 w0.254: v1(41.07,22.6) 41.07,25.59 41.63,26.15 41.63,29.91 39.49,32.05 34.79,32.05 32.45,34.4 v1(24.3,34.4)
USB_D+: length 41.3
  Top Layer w0.254: R11.2 34.72,32.12 v1(34.72,33.14) ; U9.3 v1(40.94,3.69)
  Inner1 w0.254: v1(40.94,3.69) 40.94,20.7 43.96,23.72 43.96,31.13 42.74,32.36 40.38,32.36 39.59,33.14 v1(34.72,33.14)
USB_D-: length 35.1
  Top Layer w0.254: U9.2 v1(39.94,3.69) ; R12.2 39.64,31.75 v1(40.94,31.75)
  Inner1 w0.254: v1(40.94,31.75) 42.85,31.75 43.61,30.98 43.61,23.87 39.94,20.2 39.94,18.13 40.42,17.65 40.42,8.18 39.94,7.69 v1(39.94,3.69)
XIN: length 4.6
  Top Layer w0.254: U1.20 35.57,22.29 36.05,21.81 36.05,20.37 X1.1
XOUT: length 2.9
  Top Layer w0.254: U1.21 35.97,22.4 X1.3
$1N3777: length 6.5
  Top Layer w0.254: CN6.1 41.28,18.21 42.16,18.21 42.34,18.03 42.34,14.68 U6.1
$1N4045: length 7.3
  Top Layer w0.254: CN1.1 35.27,4.88 35.64,5.25 35.64,6.04 35.47,6.21 35.39,6.21 R8.1 34.59,7.01 Q4.3
$1N4059: length 7.3
  Top Layer w0.254: Q1.3 28.49,7.01 R2.1 29.3,6.21 29.38,6.21 29.54,6.04 29.54,5.25 29.18,4.88 CN2.1
$1N4218: length 7.3
  Top Layer w0.254: CN3.1 23.08,4.88 23.44,5.25 23.44,6.04 23.28,6.21 23.2,6.21 R4.1 22.4,7.01 Q2.3
$1N4230: length 7.3
  Top Layer w0.254: Q3.3 16.3,7.01 R6.1 17.1,6.21 17.18,6.21 17.35,6.04 17.35,5.25 16.98,4.88 CN4.1
$1N6983: length 1.8
  Top Layer w0.254: U1.46 37.59,30.3 37.59,30.81 37.91,31.14 R12.1
$1N6984: length 1.9
  Top Layer w0.254: R11.1 37.19,31.15 37.19,30.48
$1N7040: length 16.6
  Top Layer w0.254: v1(23.38,14.36) 23.42,14.4 R14.1 ; v1(37.33,16.16) BOOT1.2
  Bottom Layer w0.254: v1(23.38,14.36) 35.53,14.36 v1(37.33,16.16)
$1N10693: length 7.2
  Top Layer w0.254: 11.22,0.83 11.22,5.22 11.25,5.25 11.25,6.04 11.09,6.21 11.01,6.21 R10.1 10.21,7.01 Q5.3

## Copper pours and planes (outline as drawn; the poured copper is in the pictures)
GND on Inner2: 0.26,34.74 44.74,34.74 44.74,0.26 0.26,0.26

Small or netless copper shapes (teardrops, artwork), in the pictures only: 8 on Inner2
